# Altium schematic sheet TPS53319 3.3V Buck Converter.SchDoc
size Letter; Organization: Altium Limited; Address1: L3, 12a Rodborough Rd; Address2: Frenchs Forest; Address3: NSW; Address4: Australia 2086; CopyrightYear: 2019
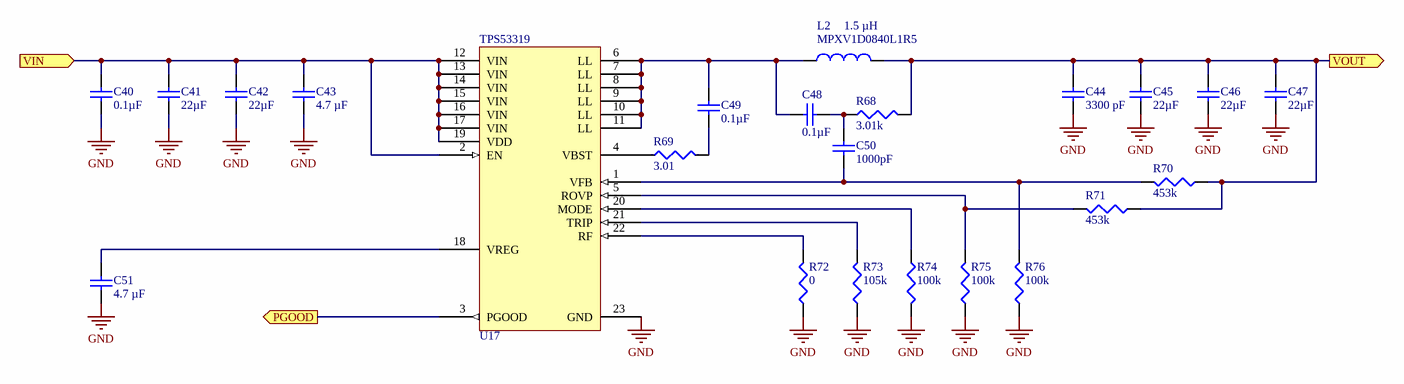
[diagram p0: TPS53319 3.3V Buck Converter.SchDoc]

## Parts
C40  value 0.1µF  [TY-TWK107]  (hidden comment: Cap)
C41  value 22µF  [TDK-C3225]  (hidden comment: Cap)
C42  value 22µF  [TDK-C3225]  (hidden comment: Cap)
C43  value 4.7 µF  [MUR-GRM188]  (hidden comment: Cap)
C44  value 3300 pF  [KEM-0402BB]  (hidden comment: Cap)
C45  value 22µF  [TDK-C3225]  (hidden comment: Cap)
C46  value 22µF  [TDK-C3225]  (hidden comment: Cap)
C47  value 22µF  [TDK-C3225]  (hidden comment: Cap)
C48  value 0.1µF  [TY-TWK107]  (hidden comment: Cap)
C49  value 0.1µF  [TY-TWK107]  (hidden comment: Cap)
C50  value 1000pF  [TDK-CGA2B]  (hidden comment: Cap)
C51  value 4.7 µF  [MUR-GRM188]  (hidden comment: Cap)
L2  value 1.5 µH  Manufacturer Part Number: MPXV1D0840L1R5  [KEM-MPXV1D0840]  (hidden comment: Inductor)
R68  value 3.01k  [VSH-CRCW0201]  (hidden comment: Res3)
R69  value 3.01  [VSH-CRCW0201]  (hidden comment: Res3)
R70  value 453k  [PANA-ERJ2R]  (hidden comment: Res3)
R71  value 453k  [PANA-ERJ2R]  (hidden comment: Res3)
R72  value 0  [PANA-ERJ2G]  (hidden comment: Jumper)
R73  value 105k  [PANA-ERJ2R]  (hidden comment: Res3)
R74  value 100k  [PANA-ERJ2R]  (hidden comment: Res3)
R75  value 100k  [PANA-ERJ2R]  (hidden comment: Res3)
R76  value 100k  [PANA-ERJ2R]  (hidden comment: Res3)
U17  TPS53319  [TI-R-PSON-N22]

## Ports
PGOOD (out), VIN (in), VOUT (out)

## Nets
GND: C40.1 C41.1 C42.1 C43.1 C44.1 C45.1 C46.1 C47.1 C51.1 R72.1 R73.1 R74.1 R75.1 R76.1 U17.23(GND)
PGOOD: U17.3(PGOOD) ; port PGOOD
VIN: C40.2 C41.2 C42.2 C43.2 U17.2(EN) U17.12(VIN) U17.13(VIN) U17.14(VIN) U17.15(VIN) U17.16(VIN) U17.17(VIN) U17.19(VDD) ; port VIN
VOUT: C44.2 C45.2 C46.2 C47.2 L2.2 R68.2 R70.1 R71.1 ; port VOUT
NetC48_1: C48.1 C50.1 R68.1
NetC48_2: C48.2 C49.2 L2.1 U17.6(LL) U17.7(LL) U17.8(LL) U17.9(LL) U17.10(LL) U17.11(LL)
NetC49_1: C49.1 R69.2
NetC50_2: C50.2 R70.2 R76.2 U17.1(VFB)
NetC51_2: C51.2 U17.18(VREG)
NetR69_1: R69.1 U17.4(VBST)
NetR71_2: R71.2 R75.2 U17.5(ROVP)
NetR72_2: R72.2 U17.22(RF)
NetR73_2: R73.2 U17.21(TRIP)
NetR74_2: R74.2 U17.20(MODE)

## Notes on the sheet
- (the "License"); you may not use or redistribute this file except in compliance with the License. You
- This file and the information within it are licensed under the terms of the Apache License, Version 2.0
- Copyright
- Unless required by applicable law or agreed to in writing, content distributed under the License is
- distributed on an "AS IS" BASIS, WITHOUT WARRANTIES OR CONDITIONS OF ANY KIND,
- either express or implied. See the License for the specific language governing permissions and
- limitations under the License.
- may obtain a copy of the License at:
- http://www.apache.org/licenses/LICENSE-2.0
- Title
- Size:
- Date:
- Letter
- Number:
- Time:
- Revision:
- Sheet
- of
- University of Alberta
- Deptartment of Electrical
- and Computer Engineering
- Edmonton AB, Canada
- T6G 1H9
- File:

## Library data of the parts
C40 C48 C49 = PC-TY-00817: CAP CER 0.1UF 25V X7R 0306; Manufacturer Part Number: TWK107B7104MVHT; Index: 817; Designator: C?; Tolerance: ±20%; Published: 2022-12-10; LatestRevisionDate: 2022-12-10; LatestRevisionNote: ...; PackageReference: 0306 (0816 Metric); Publisher: AlbertaSat; PackageDescription: Chip Capacitor, 2-Leads, Body 0.80x1.60mm, IPC Low Density; Part Number: PC-TY-00817; Supplier Part Number 1: 587-6181-1-ND; Supplier 1: Digi-key; Supplier Part Number 2: 963-TWK107B7104MVHT; Supplier 2: Mouser; Supplier Link: #https://www.digikey.ca/en/products/detail/taiyo-yuden/TWK107B7104MVHT/7403736#; Voltage-Rated: 25V; Temperature Coefficient: X7R; Application: Automotive; Operating Temperature: -55°C ~ 125°C
C41 C42 C45-C47 = PC-TDK-02965: CAP CER 22UF 25V X7R 1210; Manufacturer Part Number: C3225X7R1E226M250AB; Index: 2965; Designator: C?; Tolerance: ±20%; Code_IEC: 3225; Published: 2022-10-26; LatestRevisionDate: 2022-10-26; LatestRevisionNote: ...; PackageReference: 1210 (3225 Metric); Publisher: AlbertaSat; PackageDescription: Chip Capacitor, 2-Leads, Body 3.20x2.50mm, IPC Low Density; Part Number: PC-TDK-02965; Supplier Part Number 1: 445-181602-1-ND; Supplier 1: Digi-key; Supplier Part Number 2: 810-C3225X7R1EM250AB; Supplier 2: Mouser; Supplier Link: #https://www.digikey.ca/en/products/detail/tdk-corporation/C3225X7R1E226M250AB/9991387#; Voltage - Rated: 25V; Temperature Coefficient: X7R; Applications: General Purpose; Code_JEITA: 1210; Operating Temperature: -55°C ~ 125°C
C43 C51 = 10165: CAP CER 4.7UF 16V X7R 0603; Part Number: 10165; Manufacturer Part Number: GRM188Z71C475KE21D; Designator: C?; Tolerance: ±10%; Voltage - Rated: 25V; Published: 8-Jun-2000; LatestRevisionDate: 17-Jul-2002; LatestRevisionNote: Re-released for DXP Platform.; PackageReference: 0603 (1608 Metric); Publisher: Altium Limited; PackageDescription: Chip Capacitor, 2-Leads, Body 1.60x0.80mm, IPC Low Density; Supplier Part Number 1: 490-GRM188Z71C475KE21DCT-ND; Supplier 1: Digi-Key; Supplier Link: #https://www.digikey.ca/en/products/detail/murata-electronics/GRM188Z71C475KE21D/13401930#; Temperature Coefficient: X7R; Application: General Purpose; Operating Temperature: -55°C ~ 125°C; Supplier 2: Mouser; Supplier Part Number 2: 81-GRM188Z71C475KE1D
C44 = PC-KEM-03166: CAP CER 3300PF 50V X7R 0402; Manufacturer Part Number: C0402C332K5RAC7867; Index: 3166; Designator: C?; Tolerance: ±10%; Published: 2022-10-26; LatestRevisionDate: 2023-05-04; LatestRevisionNote: Added operating temperature; PackageReference: 0402 (1005 Metric); Publisher: AlbertaSat; PackageDescription: Chip Capacitor, 2-Leads, Body 1.00x0.50mm, IPC Low Density; Part Number: PC-KEM-03166; Supplier Part Number 1: 399-C0402C332K5RAC7867CT-ND; Supplier 1: Digi-key; Supplier Part Number 2: 80-C0402C332K5RAC; Supplier 2: Mouser; Supplier Link: #https://www.digikey.ca/en/products/detail/kemet/C0402C332K5RAC7867/501972?s=N4IgTCBcDaIMwE4EFoDCAGALOsq5zAGkBWAJQEFUB2ADgDYrUAVZAOQBEQBdAXyA#; Voltage - Rated: 50V; Temperature Coefficient: X7R; Applications: Bypass, Decoupling; Operating Temperature: -55°C ~ 125°C
C50 = PC-TDK-01454: CAP CER 1000PF 100V C0G 0402; Manufacturer Part Number: CGA2B1C0G2A102J050BC; Index: 1454; Designator: C?; Tolerance: ±5%; Temperature Coefficient: NP0; Published: 2016-03-16; LatestRevisionDate: 2016-03-16; LatestRevisionNote: ...; PackageReference: 0402 (1005 Metric); Publisher: AlbertaSat; PackageDescription: Radial Cap, Thru-Hole; 2 Leads; 0.3 in Pin Spacing; Part Number: PC-TDK-01454; Supplier Part Number 1: 445-172682-1-ND; Supplier 1: Digi-key; Supplier Link: http://www.digikey.ca/product-search/en?keywords=445-172682-1-ND; Voltage - Rated: 100V; Applications: Automotive; Operating Temperature: -55°C ~ 125°C
L2 = PL-KEM-03165: FIXED IND 1.5UH 16.2A 6.8MOHM SM; Code_IEC: 1005; Index: 3165; Designator: L?; Tolerance: ±20%; Published: 2022-10-26; LatestRevisionDate: 2023-05-04; LatestRevisionNote: Added operating temperature; PackageReference: 0.341" L x 0.315" W (8.65mm x 8.00mm); Publisher: AlbertaSat; PackageDescription: Precision Wire Wound Inductor, 2-Leads, Body 8.65x8.00mm, IPC Low Density; Code_JEITA: 0402; Part Number: PL-KEM-03165; Supplier Part Number 1: 399-MPXV1D0840L1R5CT-ND; Supplier 1: Digi-key; Supplier Part Number 2: 80-MPXV1D0840L1R5; Supplier 2: Mouser; Supplier Link: #https://www.digikey.ca/en/products/detail/kemet/MPXV1D0840L1R5/11314594?s=N4IgTCBcDaILIAUAaA1AjAEQAwA4AsWAMmgEoCsIAugL5A#; Operating Temperature: -55°C ~ 155°C
R68 = PR-VSH-00325: RES SMD 3.01K OHM 1% 1/20W 0201; Manufacturer Part Number: CRCW02013K01FKED; Index: 325; Designator: R?; Power - Rated: 0.05W, 1/20W; Temperature Coefficient: ±100ppm/°C; Published: 2022-12-11; LatestRevisionDate: 2022-12-11; LatestRevisionNote: ...; PackageReference: 0201 (0603 Metric); Publisher: AlbertaSat; PackageDescription: Chip Resistor, 2-Leads, Body 0.60x0.30mm, IPC Low Density; Part Number: PR-VSH-00325; Supplier Part Number 1: 541-3.01KAABCT-ND; Supplier 1: Digi-key; Supplier Part Number 2: 71-CRCW02013K01FKED; Supplier 2: Mouser; Supplier Link: #https://www.digikey.ca/en/products/detail/vishay-dale/CRCW02013K01FKED/1968056#; Tolerance: ±1%; Operating Temperature: -55°C ~ 155°C
R69 = PR-VSH-00326: CRCW0201 - 200/+400 3R01 1% ET7; Manufacturer Part Number: CRCW02013R01FXED; Index: 326; Designator: R?; Power - Rated: 0.05W, 1/20W; Temperature Coefficient: -200/ +400ppm/°C; Published: 2022-12-11; LatestRevisionDate: 2022-12-11; LatestRevisionNote: ...; PackageReference: 0201 (0603 Metric); Publisher: AlbertaSat; PackageDescription: Chip Resistor, 2-Leads, Body 0.60x0.30mm, IPC Low Density; Part Number: PR-VSH-00326; Supplier Part Number 1: 541-CRCW02013R01FXEDCT-ND; Supplier 1: Digi-key; Supplier Part Number 2: CRCW02013R01FXED; Supplier 2: Avnet; Supplier Link: #https://www.digikey.ca/en/products/detail/vishay-dale/CRCW02013R01FXED/10458991#; Tolerance: ±1%; Operating Temperature: -55°C ~ 155°C
R70 R71 = 19391: RES SMD 453K OHM 1% 1/10W 0402; Part Number: 19391; Manufacturer Part Number: ERJ-2RKF4533X; Designator: R?; Power: 0.1W, 1/10W; Temperature Coefficient: ±100ppm/°C; Published: 8-Jun-2000; LatestRevisionDate: 29-May-2009; LatestRevisionNote: IPC-7351 Footprint Added.; PackageReference: 0402 (1005 Metric); Publisher: Altium Limited; PackageDescription: Chip Resistor, 2-Leads, Body 1.00x0.50mm, IPC Low Density; Supplier Part Number 1: P453KLCT-ND; Supplier 1: Digi-Key; Supplier Link: http://www.digikey.ca/product-search/en?keywords=P453KLCT-ND; Tolerance: ±1%; Operating Temperature: -55°C ~ 155°C
R72 = 13127: RES SMD 0.0OHM JUMPER 1/10W 0402; Part Number: 13127; Manufacturer Part Number: ERJ-2GE0R00X; Designator: R?; Power: 0.1W, 1/10W; PackageDescription: Chip Resistor, 2-Leads, Body 1.00x0.50mm, IPC Low Density; Supplier Part Number 1: P0.0JCT-ND; Supplier 1: Digi-Key; Supplier Link: http://www.digikey.ca/product-search/en?keywords=P0.0JCT-ND; PackageReference: 0402 (1005 Metric); Tolerance: Jumper; Temperature Coefficient: -; Type: Jumper; Operating Temperature: -55°C ~ 155°C; Supplier 2: Mouser; Supplier Part Number 2: 667-ERJ-2GE0R00X
R73 = 18767: RES SMD 105K OHM 1% 1/10W 0402; Part Number: 18767; Manufacturer Part Number: ERJ-2RKF1053X; Designator: R?; Power: 0.1W, 1/10W; Temperature Coefficient: ±100ppm/°C; Published: 8-Jun-2000; LatestRevisionDate: 29-May-2009; LatestRevisionNote: IPC-7351 Footprint Added.; PackageReference: 0402 (1005 Metric); Publisher: Altium Limited; PackageDescription: Chip Resistor, 2-Leads, Body 1.00x0.50mm, IPC Low Density; Supplier Part Number 1: P105KLCT-ND; Supplier 1: Digi-Key; Supplier Link: http://www.digikey.ca/product-search/en?keywords=P105KLCT-ND; Tolerance: ±1%; Operating Temperature: -55°C ~ 155°C
R74-R76 = 18739: RES SMD 100K OHM 1% 1/10W 0402; Part Number: 18739; Manufacturer Part Number: ERJ-2RKF1003X; Designator: R?; Power: 0.1W, 1/10W; Temperature Coefficient: ±100ppm/°C; Published: 8-Jun-2000; LatestRevisionDate: 29-May-2009; LatestRevisionNote: IPC-7351 Footprint Added.; PackageReference: 0402 (1005 Metric); Publisher: Altium Limited; PackageDescription: Chip Resistor, 2-Leads, Body 1.00x0.50mm, IPC Low Density; Supplier Part Number 1: P100KLCT-ND; Supplier 1: Digi-Key; Supplier Link: http://www.digikey.ca/product-search/en?keywords=P100KLCT-ND; Tolerance: ±1%; Operating Temperature: -55°C ~ 155°C
U17 = 145: IC REG BUCK ADJUSTABLE 14A 22SON; Part Number: 145; Designator: U?; Supplier Part Number 2: 595-TPS53319DQPT; Supplier 2: Mouser; Manufacturer Part Number: TPS53319DQPT; Supplier Part Number 1: 296-39410-1-ND; Supplier 1: Digi-Key; Supplier Link: #https://www.digikey.ca/en/products/detail/texas-instruments/TPS53319DQPT/3471186#; PackageReference: TI-R-PSON-N22; Operating Temperature: -40°C ~ 85°C (TA)